# Altium project FMCOMMS3_compatible_board.PrjPcb
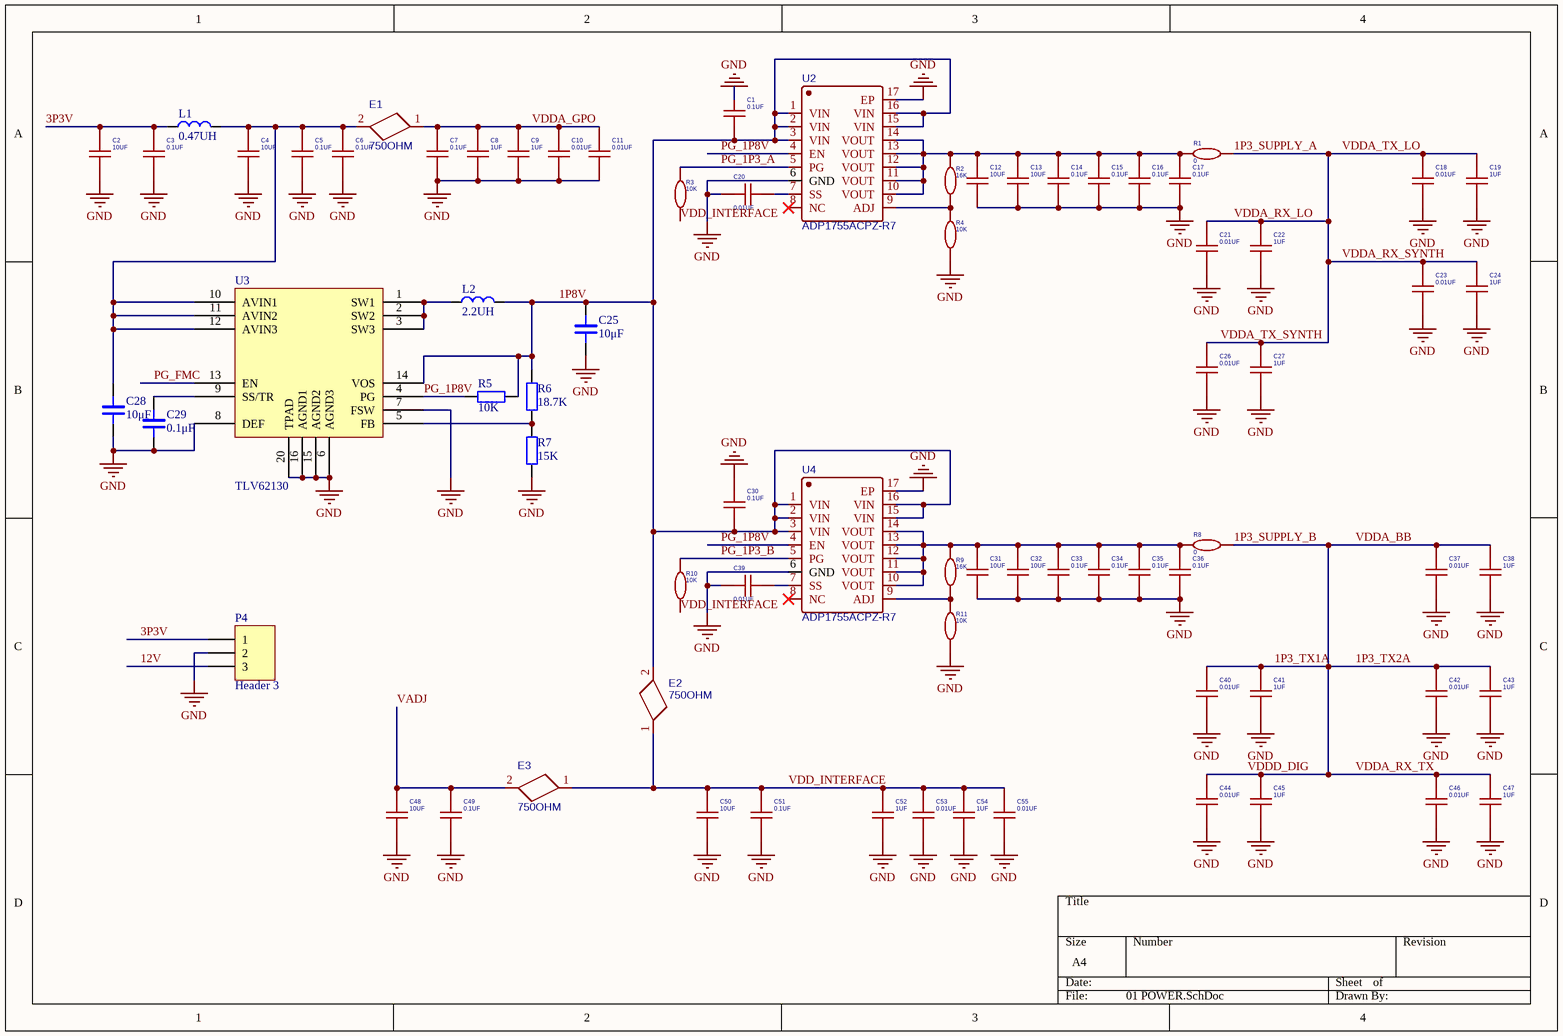
[diagram p0: 01 POWER.SchDoc]
3 sheets, 167 parts. Net scope: global (net labels, ports and power ports of the same name join across sheets).
Board file: FMCOMMS3.PcbDoc
Sheets:
  01 POWER.SchDoc
  02 LP_FMC.SchDoc
  03 AD9361_Digital.SchDoc

## Sheet 01 POWER.SchDoc
size A4

### Parts
C1  0.1UF  [C0402]
C2  10UF  [C0402]
C3  0.1UF  [C0402]
C4  10UF  [C0402]
C5  0.1UF  [C0402]
C6  0.1UF  [C0402]
C7  0.1UF  [C0402]
C8  1UF  [C0402]
C9  1UF  [C0402]
C10  0.01UF  [C0201]
C11  0.01UF  [C0201]
C12  10UF  [C0402]
C13  10UF  [C0402]
C14  0.1UF  [C0402]
C15  0.1UF  [C0402]
C16  0.1UF  [C0402]
C17  0.1UF  [C0402]
C18  0.01UF  [C0201]
C19  1UF  [C0402]
C20  0.01UF  [C0201]
C21  0.01UF  [C0201]
C22  1UF  [C0402]
C23  0.01UF  [C0201]
C24  1UF  [C0402]
C25  10μF  [C0402]
C26  0.01UF  [C0201]
C27  1UF  [C0402]
C28  10μF  [C0402]
C29  0.1μF  [C0402]
C30  0.1UF  [C0402]
C31  10UF  [C0402]
C32  10UF  [C0402]
C33  0.1UF  [C0402]
C34  0.1UF  [C0402]
C35  0.1UF  [C0402]
C36  0.1UF  [C0402]
C37  0.01UF  [C0402]
C38  1UF  [C0402]
C39  0.01UF  [C0402]
C40  0.01UF  [C0402]
C41  1UF  [C0402]
C42  0.01UF  [C0201]
C43  1UF  [C0402]
C44  0.01UF  [C0201]
C45  1UF  [C0402]
C46  0.01UF  [C0402]
C47  1UF  [C0402]
C48  10UF  [C0603]
C49  0.1UF  [C0402]
C50  10UF  [C0402]
C51  0.1UF  [C0201]
C52  1UF  [C0402]
C53  0.01UF  [C0201]
C54  1UF  [C0402]
C55  0.01UF  [C0201]
E1  750OHM  [L0402]
E2  750OHM  [L0402]
E3  750OHM  [L0402]
L1  0.47UH  [L1008]
L2  2.2UH  [L1008]
P4  Header 3  [CNBERG1X3H205LD36]
R1  0  [R1206]
R2  16K  [LC-0402_R]
R3  10K  [C0201]
R4  10K  [LC-0402_R]
R5  10K  [LC-0402_R]
R6  18.7K  [LC-0402_R]
R7  15K  [LC-0402_R]
R8  0  [R1206]
R9  16K  [LC-0402_R]
R10  10K  [LC-0402_R]
R11  10K  [LC-0402_R]
U2  ADP1755ACPZ-R7  [LFCSP-WQ-16_L4.0-W4.0-P0.65-EP2.3-BL-EP]
U3  TLV62130  [TLV62130RGT]
U4  ADP1755ACPZ-R7  [LFCSP-WQ-16_L4.0-W4.0-P0.65-EP2.3-BL-EP]

### Nets
GND: C1.1 C2.2 C3.2 C4.2 C5.2 C6.2 C7.2 C8.2 C9.2 C10.2 C11.2 C12.2 C13.2 C14.2 C15.2 C16.2 C17.2 C18.2 C19.2 C20.2 C21.2 C22.2 C23.2 C24.2 C25.1 C26.2 C27.2 C28.1 C29.1 C30.1 C31.2 C32.2 C33.2 C34.2 C35.2 C36.2 C37.2 C38.2 C39.2 C40.2 C41.2 C42.2 C43.2 C44.2 C45.2 C46.2 C47.2 C48.2 C49.2 C50.2 C51.2 C52.2 C53.2 C54.2 C55.2 P4.2 R4.1 R7.2 R11.1 U2.6(GND) U2.17(EP) U3.6(AGND3) U3.7(FSW) U3.8(DEF) U3.15(AGND2) U3.16(AGND1) U3.20(TPAD) U4.6(GND) U4.17(EP)
VDD_INTERFACE: C50.1 C51.1 C52.1 C53.1 C54.1 C55.1 E2.1 E3.1 R3.1 R10.1
1P3_SUPPLY_A: C18.1 C19.1 C21.1 C22.1 C23.1 C24.1 C26.1 C27.1 R1.2  [also labelled VDDA_RX_LO, VDDA_RX_SYNTH, VDDA_TX_LO, VDDA_TX_SYNTH]
1P3_SUPPLY_B: C37.1 C38.1 C40.1 C41.1 C42.1 C43.1 C44.1 C45.1 C46.1 C47.1 R8.2  [also labelled 1P3_TX1A, 1P3_TX2A, VDDA_BB, VDDA_RX_TX, VDDD_DIG]
1P8V: C1.2 C25.2 C30.2 E2.2 L2.2 R5.1 R6.1 U2.1(VIN) U2.2(VIN) U2.3(VIN) U2.15(VIN) U2.16(VIN) U3.14(VOS) U4.1(VIN) U4.2(VIN) U4.3(VIN) U4.15(VIN) U4.16(VIN)
3P3V: C2.1 C3.1 L1.1 P4.1
12V: P4.3
PG_1P3_A: R3.2 U2.5(PG)
PG_1P3_B: R10.2 U4.5(PG)
PG_1P8V: R5.2 U2.4(EN) U3.4(PG) U4.4(EN)
PG_FMC: U3.13(EN)
VADJ: C48.1 C49.1 E3.2
VDDA_GPO: C7.1 C8.1 C9.1 C10.1 C11.1 E1.1
NetC4_1: C4.1 C5.1 C6.1 C28.2 E1.2 L1.2 U3.10(AVIN1) U3.11(AVIN2) U3.12(AVIN3)
NetC12_1: C12.1 C13.1 C14.1 C15.1 C16.1 C17.1 R1.1 R2.2 U2.10(VOUT) U2.11(VOUT) U2.12(VOUT) U2.13(VOUT) U2.14(VOUT)
NetC20_1: C20.1 U2.7(SS)
NetC29_2: C29.2 U3.9(SS/TR)
NetC31_1: C31.1 C32.1 C33.1 C34.1 C35.1 C36.1 R8.1 R9.2 U4.10(VOUT) U4.11(VOUT) U4.12(VOUT) U4.13(VOUT) U4.14(VOUT)
NetC39_1: C39.1 U4.7(SS)
NetL2_1: L2.1 U3.1(SW1) U3.2(SW2) U3.3(SW3)
NetR2_1: R2.1 R4.2 U2.9(ADJ)
NetR6_2: R6.2 R7.1 U3.5(FB)
NetR9_1: R9.1 R11.2 U4.9(ADJ)

Not connected (* = marked no-connect by the designer): U2 8(NC)*; U4 8(NC)*

### Library data of the parts
C1 C3 C5-C7 C14-C17 C30 C33-C36 C49 C51 = 0.1UF: BOM_Manufacturer: WTC; BOM_Manufacturer Part: 0402B104K160; nameAlias: Capacitance; BOM_Supplier: LCSC; BOM_Supplier Part: C83056; spicePre: C; spiceSymbolName: 0402B104K160
C2 C4 C8-C13 C18 C19 C21-C24 C26 C27 C31 C32 C37 C38 C40-C48 C50 C52-C55 = 10UF: BOM_Manufacturer: WTC; BOM_Manufacturer Part: 0402B104K160; nameAlias: Capacitance; BOM_Supplier: LCSC; BOM_Supplier Part: C83056; spicePre: C; spiceSymbolName: 0402B104K160
C20 C39 = 0.01UF: BOM_Manufacturer: WTC; BOM_Manufacturer Part: 0402B104K160; nameAlias: Capacitance; BOM_Supplier: LCSC; BOM_Supplier Part: C83056; spicePre: C; spiceSymbolName: 0402B104K160
C25 C28 C29 = CAP_3: Capacitor
E1-E3 = 100OHM: BOM_Manufacturer: Murata; BOM_Manufacturer Part: BLM21PG221SN1x; Contributor: prophetC; BOM_Supplier: LCSC; spicePre: L; spiceSymbolName: 220ohm at 100MHz
L1 L2 = INDUCTANCE_1: Inductance
P4 = Header 3: Header, 3-Pin; LatestRevisionDate: 17-Jul-2002; LatestRevisionNote: Re-released for DXP Platform.; Publisher: Altium Limited
R1 R8 = 1: BOM_Manufacturer: YAGEO; BOM_Manufacturer Part: RC0402FR-0780R6L; nameAlias: Resistance (Ohms); Contributor: LCSC; BOM_Supplier: LCSC; BOM_Supplier Part: C185392; spicePre: R; spiceSymbolName: RC0402FR-0780R6L
R2-R4 R9-R11 = 10K: BOM_Manufacturer: YAGEO; BOM_Manufacturer Part: RC0402FR-0780R6L; nameAlias: Resistance (Ohms); Contributor: LCSC; BOM_Supplier: LCSC; BOM_Supplier Part: C185392; spicePre: R; spiceSymbolName: RC0402FR-0780R6L
R5-R7 = RES: Resistor
U2 U4 = ADP1755ACPZ-R7: BOM_Manufacturer: Analog Devices; Contributor: LCSC; BOM_Paste Type: expand; BOM_Supplier: LCSC; BOM_Supplier Part: C403695; BOM_Manufacturer Part: ADP1755ACPZ-R7; spicePre: U; spiceSymbolName: ADP1755ACPZ-R7

## Sheet 02 LP_FMC.SchDoc
size A4
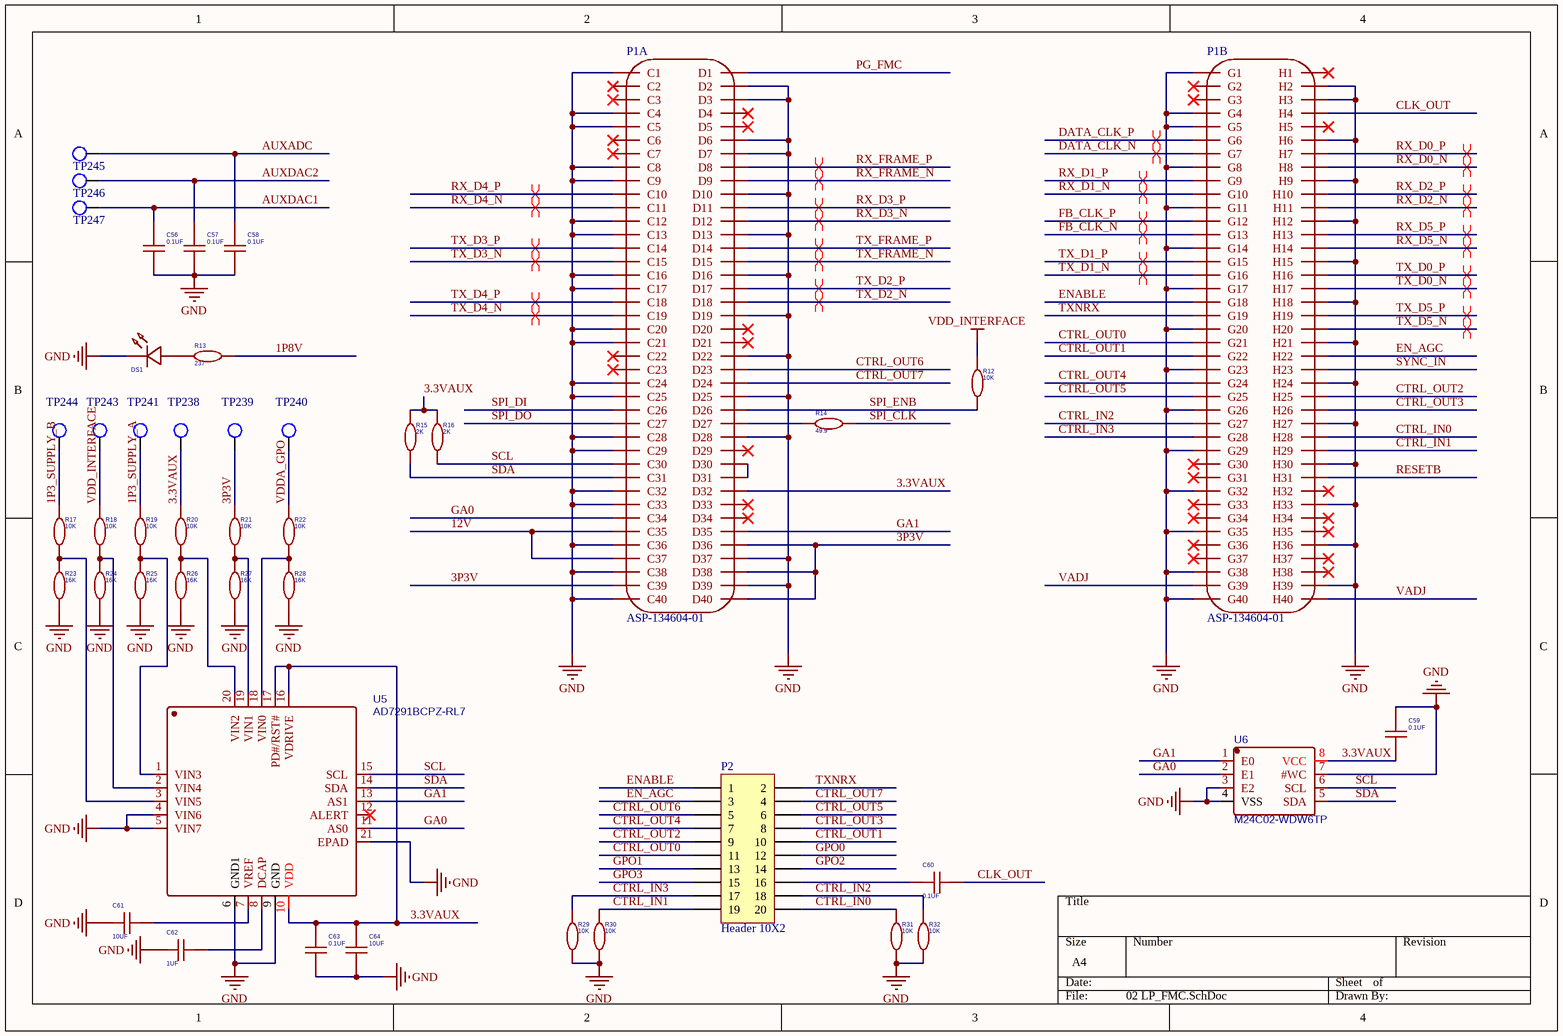
[diagram p1: 02 LP_FMC.SchDoc]

### Parts
C56  0.1UF  [C0201]
C57  0.1UF  [C0402]
C58  0.1UF  [C0201]
C59  0.1UF  [C0402]
C60  0.1UF  [C0402]
C61  10UF  [C0402]
C62  1UF  [C0402]
C63  0.1UF  [C0201]
C64  10UF  [C0402]
DS1  16-213SURC/S530-A3/TR8  [LED0805-RD]  (value not drawn)
P1  ASP-134604-01  [CNSAMTECASP-134604-01]  (parts A,B of 2)
P2  Header 10X2  [CNBERGF2X10H335LD32]
R12  10K  [C0201]
R13  237  [LC-0402_R]
R14  49.9  [C0201]
R15  2K  [C0201]
R16  2K  [C0201]
R17  10K  [C0201]
R18  10K  [C0201]
R19  10K  [C0201]
R20  10K  [C0201]
R21  10K  [C0201]
R22  10K  [C0201]
R23  16K  [C0201]
R24  16K  [C0201]
R25  16K  [C0201]
R26  16K  [C0201]
R27  16K  [C0201]
R28  16K  [C0201]
R29  10K  [C0201]
R30  10K  [C0201]
R31  10K  [C0201]
R32  10K  [C0201]
TP238  TEST POINT SURFACE  [TPC75D45]  (value not drawn)
TP239  TEST POINT SURFACE  [TPC75D45]  (value not drawn)
TP240  TEST POINT SURFACE  [TPC75D45]  (value not drawn)
TP241  TEST POINT SURFACE  [TPC75D45]  (value not drawn)
TP243  TEST POINT SURFACE  [TPC75D45]  (value not drawn)
TP244  TEST POINT SURFACE  [TPC75D45]  (value not drawn)
TP245  TEST POINT SURFACE  [TPC75D45]  (value not drawn)
TP246  TEST POINT SURFACE  [TPC75D45]  (value not drawn)
TP247  TEST POINT SURFACE  [TPC75D45]  (value not drawn)
U5  AD7291BCPZ-RL7  [LFCSP-20_L4.0-W4.0-P0.50-TL-EP2.7]
U6  M24C02-WDW6TP  [TSSOP8]

### Nets
GND: C56.2 C57.2 C58.2 C59.1 C61.1 C62.2 C63.2 C64.2 DS1.1(-) P1.C1 P1.C4 P1.C5 P1.C8 P1.C9 P1.C12 P1.C13 P1.C16 P1.C17 P1.C20 P1.C21 P1.C24 P1.C25 P1.C28 P1.C29 P1.C32 P1.C33 P1.C36 P1.C38 P1.C40 P1.D2 P1.D3 P1.D6 P1.D7 P1.D10 P1.D13 P1.D16 P1.D19 P1.D22 P1.D25 P1.D28 P1.D37 P1.D39 P1.G1 P1.G4 P1.G5 P1.G8 P1.G11 P1.G14 P1.G17 P1.G20 P1.G23 P1.G26 P1.G29 P1.G32 P1.G35 P1.G38 P1.G40 P1.H2 P1.H3 P1.H6 P1.H9 P1.H12 P1.H15 P1.H18 P1.H21 P1.H24 P1.H27 P1.H30 P1.H33 P1.H36 P1.H39 R23.2 R24.2 R25.2 R26.2 R27.2 R28.2 R29.1 R30.1 R31.1 R32.1 U5.4(VIN6) U5.5(VIN7) U5.6(GND1) U5.9(GND) U5.21(EPAD) U6.3(E2) U6.4(VSS) U6.7(#WC)
VDD_INTERFACE: R12.2 R18.1 TP243.1(TP)
1P3_SUPPLY_A: R19.1 TP241.1(TP)
1P3_SUPPLY_B: R17.1 TP244.1(TP)
1P8V: R13.2
3.3VAUX: C59.2 C63.1 C64.1 P1.D32 R15.2 R16.2 R20.1 TP238.1(TP) U5.10(VDD) U5.16(VDRIVE) U5.17(PD#/RST#) U6.8(VCC)
3P3V: P1.C39 P1.D36 P1.D38 P1.D40 R21.1 TP239.1(TP)
12V: P1.C35 P1.C37
AUXADC: C58.1 TP245.1(TP)
AUXDAC1: C56.1 TP247.1(TP)
AUXDAC2: C57.1 TP246.1(TP)
CLK_OUT: C60.2 P1.H4
CTRL_IN0: P1.H28 P2.20 R31.2
CTRL_IN1: P1.H29 P2.19 R30.2
CTRL_IN2: P1.G27 P2.18 R32.2
CTRL_IN3: P1.G28 P2.17 R29.2
CTRL_OUT0: P1.G21 P2.11
CTRL_OUT1: P1.G22 P2.10
CTRL_OUT2: P1.H25 P2.9
CTRL_OUT3: P1.H26 P2.8
CTRL_OUT4: P1.G24 P2.7
CTRL_OUT5: P1.G25 P2.6
CTRL_OUT6: P1.D23 P2.5
CTRL_OUT7: P1.D24 P2.4
DATA_CLK_N: P1.G7
DATA_CLK_P: P1.G6
EN_AGC: P1.H22 P2.3
ENABLE: P1.G18 P2.1
FB_CLK_N: P1.G13
FB_CLK_P: P1.G12
GA0: P1.C34 U5.11(AS0) U6.2(E1)
GA1: P1.D35 U5.13(AS1) U6.1(E0)
GPO0: P2.12
GPO1: P2.13
GPO2: P2.14
GPO3: P2.15
PG_FMC: P1.D1
RESETB: P1.H31
RX_D0_N: P1.H8
RX_D0_P: P1.H7
RX_D1_N: P1.G10
RX_D1_P: P1.G9
RX_D2_N: P1.H11
RX_D2_P: P1.H10
RX_D3_N: P1.D12
RX_D3_P: P1.D11
RX_D4_N: P1.C11
RX_D4_P: P1.C10
RX_D5_N: P1.H14
RX_D5_P: P1.H13
RX_FRAME_N: P1.D9
RX_FRAME_P: P1.D8
SCL: P1.C30 R16.1 U5.15(SCL) U6.6(SCL)
SDA: P1.C31 R15.1 U5.14(SDA) U6.5(SDA)
SPI_CLK: R14.2
SPI_DI: P1.C26
SPI_DO: P1.C27
SPI_ENB: P1.D26 R12.1
SYNC_IN: P1.H23
TX_D0_N: P1.H17
TX_D0_P: P1.H16
TX_D1_N: P1.G16
TX_D1_P: P1.G15
TX_D2_N: P1.D18
TX_D2_P: P1.D17
TX_D3_N: P1.C15
TX_D3_P: P1.C14
TX_D4_N: P1.C19
TX_D4_P: P1.C18
TX_D5_N: P1.H20
TX_D5_P: P1.H19
TX_FRAME_N: P1.D15
TX_FRAME_P: P1.D14
TXNRX: P1.G19 P2.2
VADJ: P1.G39 P1.H40
VDDA_GPO: R22.1 TP240.1(TP)
NetC60_1: C60.1 P2.16
NetC61_2: C61.2 U5.7(VREF)
NetC62_1: C62.1 U5.8(DCAP)
NetDS1_2: DS1.2(+) R13.1
NetP1_D27: P1.D27 R14.1
NetP1_D30: P1.D30 P1.D31
NetR17_2: R17.2 R23.1 U5.3(VIN5)
NetR18_2: R18.2 R24.1 U5.2(VIN4)
NetR19_2: R19.2 R25.1 U5.1(VIN3)
NetR20_2: R20.2 R26.1 U5.20(VIN2)
NetR21_2: R21.2 R27.1 U5.19(VIN1)
NetR22_2: R22.2 R28.1 U5.18(VIN0)

Not connected (* = marked no-connect by the designer): P1 C2* C3* C6* C7* C22* C23* D4* D5* D20* D21* D29* D33* D34* G2* G3* G30* G31* G33* G34* G36* G37* H1* H5* H32* H34* H35* H37* H38*; U5 12(ALERT)*

### Layout directives
differential pair: DATA_CLK_N, DATA_CLK_P, FB_CLK_N, FB_CLK_P, RX_D0_N, RX_D0_P, RX_D1_N, RX_D1_P, RX_D2_N, RX_D2_P, RX_D3_N, RX_D3_P, RX_D4_N, RX_D4_P, RX_D5_N, RX_D5_P, RX_FRAME_N, RX_FRAME_P, TX_D0_N, TX_D0_P, TX_D1_N, TX_D1_P, TX_D2_N, TX_D2_P, TX_D3_N, TX_D3_P, TX_D4_N, TX_D4_P, TX_D5_N, TX_D5_P, TX_FRAME_N, TX_FRAME_P

### Library data of the parts
C56-C60 C62 C63 = 0.1UF: as C1 on sheet 01 POWER; BOM_Supplier: LCSC; BOM_Supplier Part: C83056; spicePre: C; spiceSymbolName: 0402B104K160
C61 C64 = 10UF: as C2 on sheet 01 POWER; BOM_Supplier: LCSC; BOM_Supplier Part: C83056; spicePre: C; spiceSymbolName: 0402B104K160
DS1 = 16-213SURC/S530-A3/TR8: BOM_Manufacturer: Everlight Elec; Contributor: LCSC; BOM_Supplier: LCSC; BOM_Supplier Part: C605452; BOM_Manufacturer Part: 16-213SURC/S530-A3/TR8; spicePre: L; spiceSymbolName: 16-213SURC/S530-A3/TR8
P2 = Header 10X2: Header, 10-Pin, Dual row; LatestRevisionDate: 17-Jul-2002; LatestRevisionNote: Re-released for DXP Platform.; Publisher: Altium Limited
R12 R17-R32 = 10K: as R2 on sheet 01 POWER; BOM_Supplier: LCSC; BOM_Supplier Part: C185392; spicePre: R; spiceSymbolName: RC0402FR-0780R6L
R13 = 10R: BOM_Manufacturer: YAGEO; BOM_Manufacturer Part: RC0402FR-0780R6L; nameAlias: Resistance (Ohms); Contributor: LCSC; BOM_Supplier: LCSC; BOM_Supplier Part: C185392; spicePre: R; spiceSymbolName: RC0402FR-0780R6L
R14 = 39: BOM_Manufacturer: YAGEO; BOM_Manufacturer Part: RC0402FR-0780R6L; nameAlias: Resistance (Ohms); Contributor: LCSC; BOM_Supplier: LCSC; BOM_Supplier Part: C185392; spicePre: R; spiceSymbolName: RC0402FR-0780R6L
R15 R16 = 1K: BOM_Manufacturer: YAGEO; BOM_Manufacturer Part: RC0402FR-0780R6L; nameAlias: Resistance (Ohms); Contributor: LCSC; BOM_Supplier: LCSC; BOM_Supplier Part: C185392; spicePre: R; spiceSymbolName: RC0402FR-0780R6L
TP238-TP241 TP243-TP247 = TEST POINT SURFACE_1
U5 = AD7291BCPZ-RL7: BOM_Manufacturer: Analog Devices; Contributor: LCSC; BOM_Paste Type: expand; BOM_Supplier: LCSC; BOM_Supplier Part: C207434; BOM_Manufacturer Part: AD7291BCPZ-RL7; spicePre: U; spiceSymbolName: AD7291BCPZ-RL7
U6 = M24C02-WDW6TP: BOM_Manufacturer: STMicroelectronics; Contributor: LCSC; BOM_Paste Type: expand; BOM_Supplier: LCSC; BOM_Supplier Part: C283436; BOM_Manufacturer Part: M24C02-WDW6TP; spicePre: U; spiceSymbolName: M24C02-WDW6TP

## Sheet 03 AD9361_Digital.SchDoc
size A3
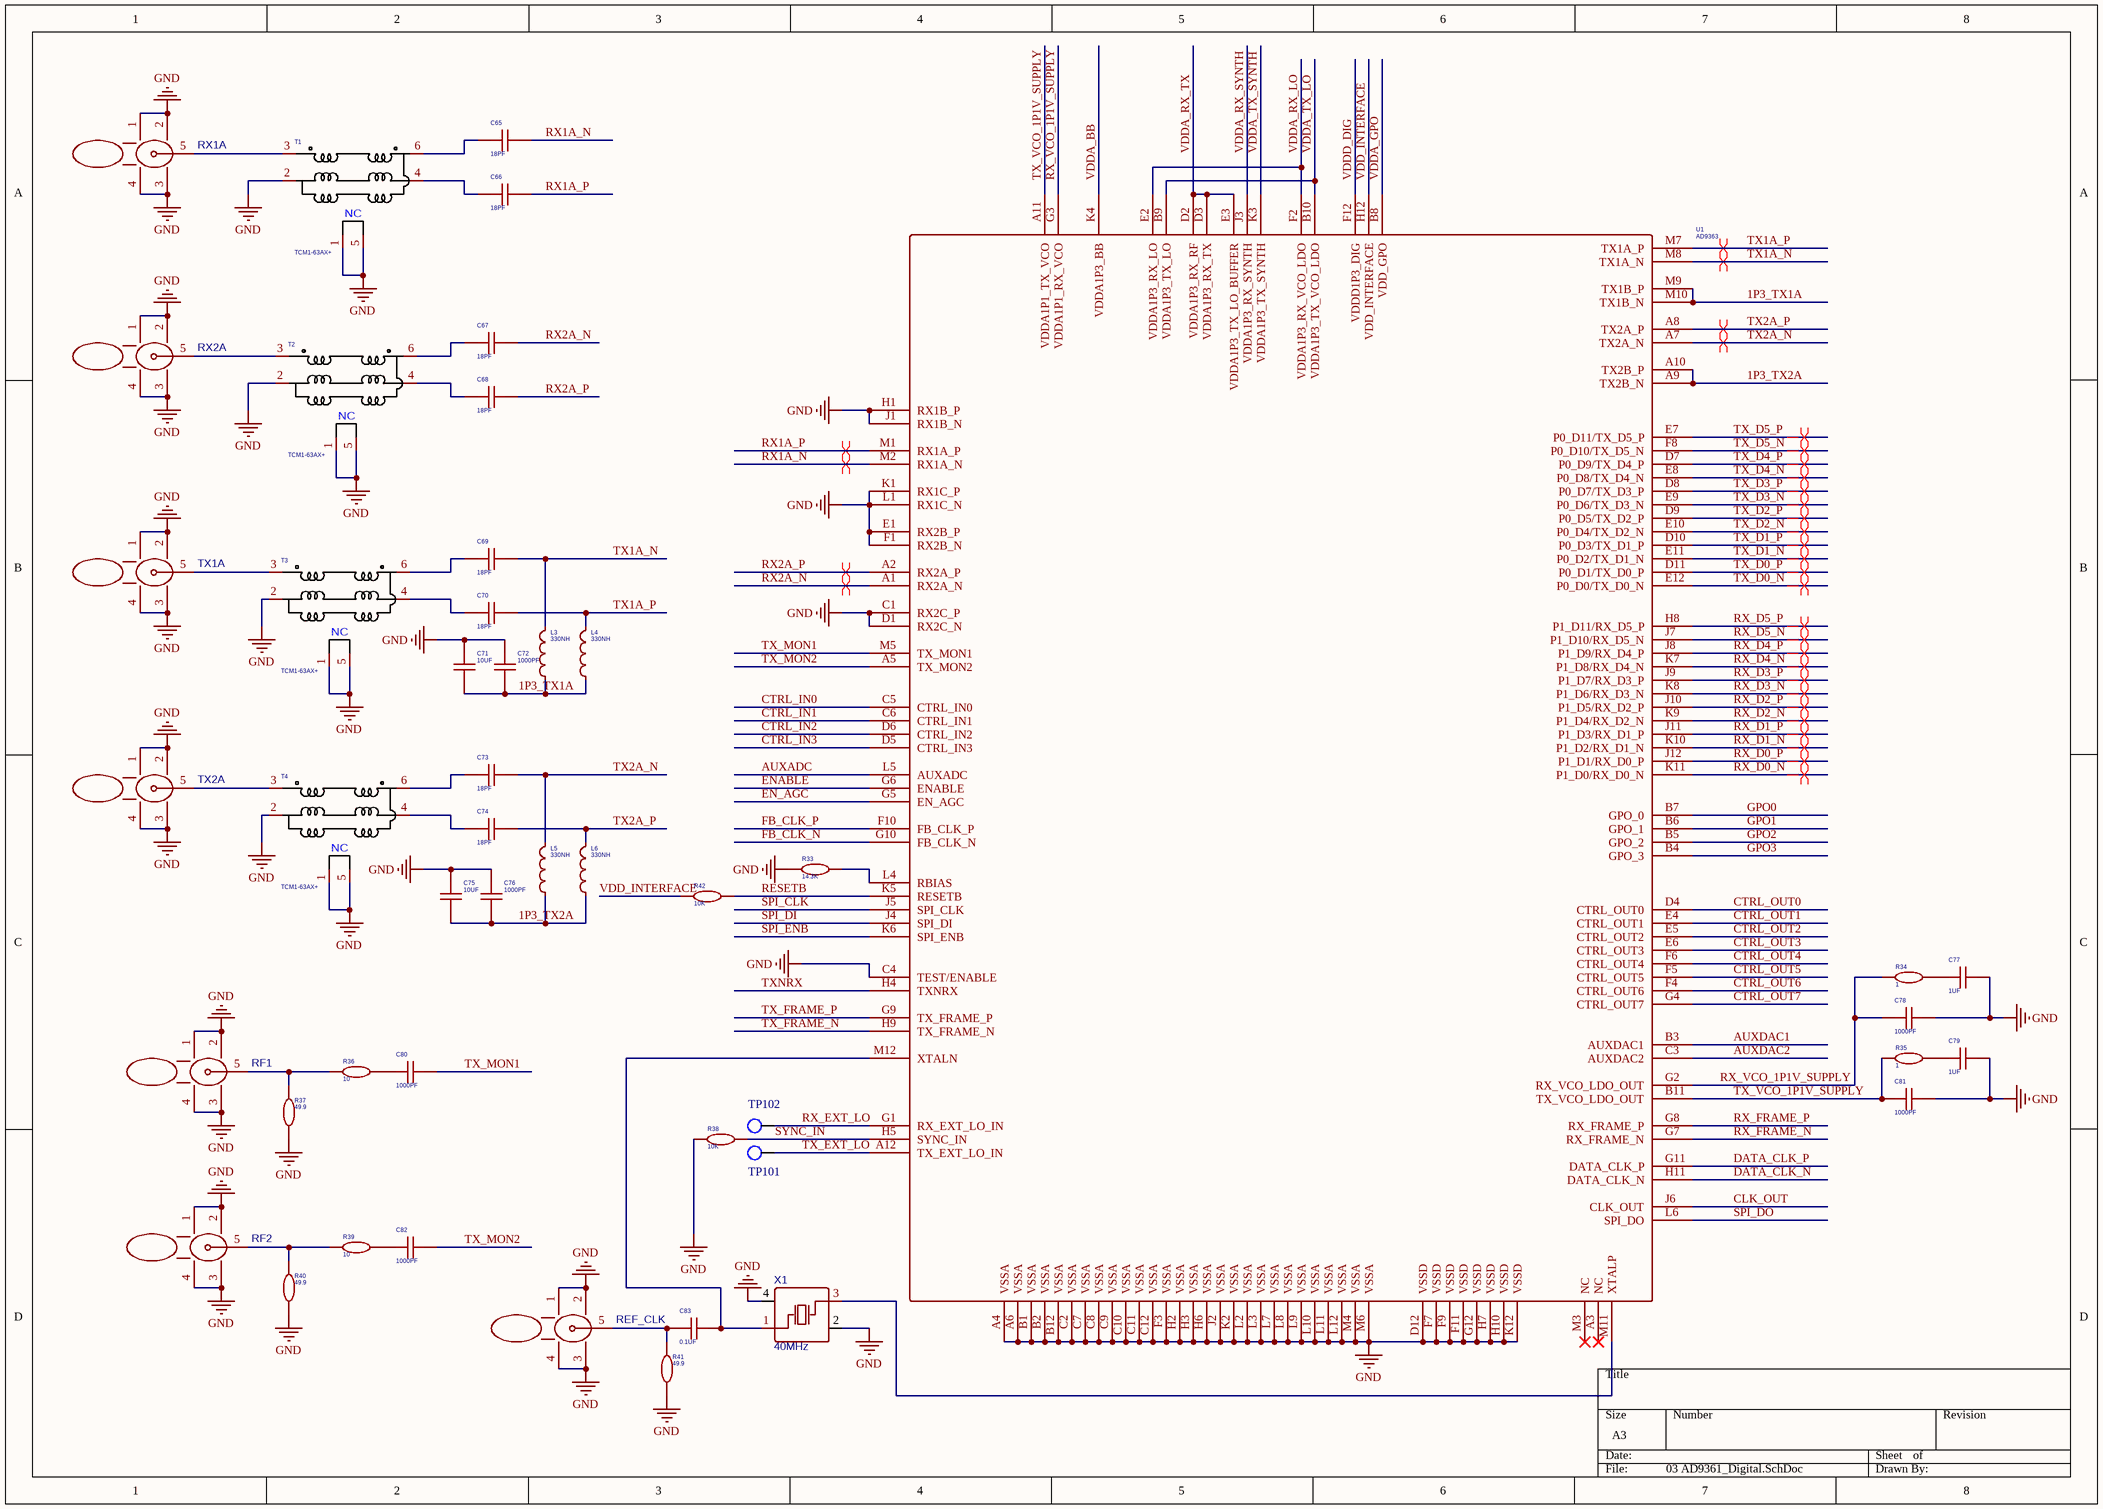
[diagram p2: 03 AD9361_Digital.SchDoc]

### Parts
C65  18PF  [C0201]
C66  18PF  [C0201]
C67  18PF  [C0201]
C68  18PF  [C0201]
C69  18PF  [C0201]
C70  18PF  [C0201]
C71  10UF  [C0402]
C72  1000PF  [C0201]
C73  18PF  [C0201]
C74  18PF  [C0201]
C75  10UF  [C0603]
C76  1000PF  [C0402]
C77  1UF  [C0402]
C78  1000PF  [C0201]
C79  1UF  [C0402]
C80  1000PF  [C0201]
C81  1000PF  [C0201]
C82  1000PF  [C0201]
C83  0.1UF  [C0402]
L3  330NH  [L0805-F]
L4  330NH  [L0805-F]
L5  330NH  [L0805-F]
L6  330NH  [L0805-F]
R33  14.3K  [C0201]
R34  1  [C0201]
R35  1  [C0201]
R36  10  [C0201]
R37  49.9  [LC-0402_R]
R38  10K  [C0201]
R39  10  [C0201]
R40  49.9  [C0201]
R41  49.9  [LC-0402_R]
R42  10K  [R0201]
REF_CLK  DOSIN-806-0010  [CNJOHNSON142-0701-201]  (value not drawn)
RF1  DOSIN-806-0010  [CNSMARAL687W375H171]  (value not drawn)
RF2  DOSIN-806-0010  [CNSMARAL687W375H171]  (value not drawn)
RX1A  DOSIN-806-0010  [CNSMARAL687W375H171]  (value not drawn)
RX2A  DOSIN-806-0010  [CNSMARAL687W375H171]  (value not drawn)
T1  TCM1-63AX+  [TSML150W160H160]
T2  TCM1-63AX+  [TSML150W160H160]
T3  TCM1-63AX+  [TSML150W160H160]
T4  TCM1-63AX+  [TSML150W160H160]
TP101  TEST POINT SURFACE  [TPC75D45]  (value not drawn)
TP102  TEST POINT SURFACE  [TPC75D45]  (value not drawn)
TX1A  DOSIN-806-0010  [CNSMARAL687W375H171]  (value not drawn)
TX2A  DOSIN-806-0010  [CNSMARAL687W375H171]  (value not drawn)
U1  AD9363  [AD936X]
X1  40MHz  [XTALNX3225]

### Nets
GND: C71.1 C72.1 C75.1 C76.1 C77.1 C78.2 C79.1 C81.2 R33.1 R37.1 R38.1 R40.1 R41.1 REF_CLK.1 REF_CLK.2 REF_CLK.3 REF_CLK.4 RF1.1 RF1.2 RF1.3 RF1.4 RF2.1 RF2.2 RF2.3 RF2.4 RX1A.1 RX1A.2 RX1A.3 RX1A.4 RX2A.1 RX2A.2 RX2A.3 RX2A.4 T1.1(NC) T1.2 T1.5(NC) T2.1(NC) T2.2 T2.5(NC) T3.1(NC) T3.2 T3.5(NC) T4.1(NC) T4.2 T4.5(NC) TX1A.1 TX1A.2 TX1A.3 TX1A.4 TX2A.1 TX2A.2 TX2A.3 TX2A.4 U1.A4(VSSA) U1.A6(VSSA) U1.B1(VSSA) U1.B2(VSSA) U1.B12(VSSA) U1.C1(RX2C_P) U1.C2(VSSA) U1.C4(TEST/ENABLE) U1.C7(VSSA) U1.C8(VSSA) U1.C9(VSSA) U1.C10(VSSA) U1.C11(VSSA) U1.C12(VSSA) U1.D1(RX2C_N) U1.D12(VSSD) U1.E1(RX2B_P) U1.F1(RX2B_N) U1.F3(VSSA) U1.F7(VSSD) U1.F9(VSSD) U1.F11(VSSD) U1.G12(VSSD) U1.H1(RX1B_P) U1.H2(VSSA) U1.H3(VSSA) U1.H6(VSSA) U1.H7(VSSD) U1.H10(VSSD) U1.J1(RX1B_N) U1.J2(VSSA) U1.K1(RX1C_P) U1.K2(VSSA) U1.K12(VSSD) U1.L1(RX1C_N) U1.L2(VSSA) U1.L3(VSSA) U1.L7(VSSA) U1.L8(VSSA) U1.L9(VSSA) U1.L10(VSSA) U1.L11(VSSA) U1.L12(VSSA) U1.M4(VSSA) U1.M6(VSSA) X1.2(GND) X1.4(GND)
VDD_INTERFACE: R42.1 U1.H12(VDD_INTERFACE)
1P3_TX1A: C71.2 C72.2 C75.2 C76.2 L3.1 L4.1 L5.1 L6.1 U1.A9(TX2B_N) U1.A10(TX2B_P) U1.D2(VDDA1P3_RX_RF) U1.D3(VDDA1P3_RX_TX) U1.E3(VDDA1P3_TX_LO_BUFFER) U1.F12(VDDD1P3_DIG) U1.K4(VDDA1P3_BB) U1.M9(TX1B_P) U1.M10(TX1B_N)  [also labelled 1P3_TX2A, VDDA_BB, VDDA_RX_TX, VDDD_DIG]  [project net 1P3_SUPPLY_B]
AUXADC: U1.L5(AUXADC)
AUXDAC1: U1.B3(AUXDAC1)
AUXDAC2: U1.C3(AUXDAC2)
CLK_OUT: U1.J6(CLK_OUT)
CTRL_IN0: U1.C5(CTRL_IN0)
CTRL_IN1: U1.C6(CTRL_IN1)
CTRL_IN2: U1.D6(CTRL_IN2)
CTRL_IN3: U1.D5(CTRL_IN3)
CTRL_OUT0: U1.D4(CTRL_OUT0)
CTRL_OUT1: U1.E4(CTRL_OUT1)
CTRL_OUT2: U1.E5(CTRL_OUT2)
CTRL_OUT3: U1.E6(CTRL_OUT3)
CTRL_OUT4: U1.F6(CTRL_OUT4)
CTRL_OUT5: U1.F5(CTRL_OUT5)
CTRL_OUT6: U1.F4(CTRL_OUT6)
CTRL_OUT7: U1.G4(CTRL_OUT7)
DATA_CLK_N: U1.H11(DATA_CLK_N)
DATA_CLK_P: U1.G11(DATA_CLK_P)
EN_AGC: U1.G5(EN_AGC)
ENABLE: U1.G6(ENABLE)
FB_CLK_N: U1.G10(FB_CLK_N)
FB_CLK_P: U1.F10(FB_CLK_P)
GPO0: U1.B7(GPO_0)
GPO1: U1.B6(GPO_1)
GPO2: U1.B5(GPO_2)
GPO3: U1.B4(GPO_3)
RESETB: R42.2 U1.K5(RESETB)
RX1A_N: C65.1 U1.M2(RX1A_N)
RX1A_P: C66.1 U1.M1(RX1A_P)
RX2A_N: C67.1 U1.A1(RX2A_N)
RX2A_P: C68.1 U1.A2(RX2A_P)
RX_D0_N: U1.K11(P1_D0/RX_D0_N)
RX_D0_P: U1.J12(P1_D1/RX_D0_P)
RX_D1_N: U1.K10(P1_D2/RX_D1_N)
RX_D1_P: U1.J11(P1_D3/RX_D1_P)
RX_D2_N: U1.K9(P1_D4/RX_D2_N)
RX_D2_P: U1.J10(P1_D5/RX_D2_P)
RX_D3_N: U1.K8(P1_D6/RX_D3_N)
RX_D3_P: U1.J9(P1_D7/RX_D3_P)
RX_D4_N: U1.K7(P1_D8/RX_D4_N)
RX_D4_P: U1.J8(P1_D9/RX_D4_P)
RX_D5_N: U1.J7(P1_D10/RX_D5_N)
RX_D5_P: U1.H8(P1_D11/RX_D5_P)
RX_EXT_LO: TP102.1(TP) U1.G1(RX_EXT_LO_IN)
RX_FRAME_N: U1.G7(RX_FRAME_N)
RX_FRAME_P: U1.G8(RX_FRAME_P)
RX_VCO_1P1V_SUPPLY: C78.1 R34.1 U1.G2(RX_VCO_LDO_OUT) U1.G3(VDDA1P1_RX_VCO)
SPI_CLK: U1.J5(SPI_CLK)
SPI_DI: U1.J4(SPI_DI)
SPI_DO: U1.L6(SPI_DO)
SPI_ENB: U1.K6(SPI_ENB)
SYNC_IN: R38.2 U1.H5(SYNC_IN)
TX1A_N: C69.1 L3.2 U1.M8(TX1A_N)
TX1A_P: C70.1 L4.2 U1.M7(TX1A_P)
TX2A_N: C73.1 L5.2 U1.A7(TX2A_N)
TX2A_P: C74.1 L6.2 U1.A8(TX2A_P)
TX_D0_N: U1.E12(P0_D0/TX_D0_N)
TX_D0_P: U1.D11(P0_D1/TX_D0_P)
TX_D1_N: U1.E11(P0_D2/TX_D1_N)
TX_D1_P: U1.D10(P0_D3/TX_D1_P)
TX_D2_N: U1.E10(P0_D4/TX_D2_N)
TX_D2_P: U1.D9(P0_D5/TX_D2_P)
TX_D3_N: U1.E9(P0_D6/TX_D3_N)
TX_D3_P: U1.D8(P0_D7/TX_D3_P)
TX_D4_N: U1.E8(P0_D8/TX_D4_N)
TX_D4_P: U1.D7(P0_D9/TX_D4_P)
TX_D5_N: U1.F8(P0_D10/TX_D5_N)
TX_D5_P: U1.E7(P0_D11/TX_D5_P)
TX_EXT_LO: TP101.1(TP) U1.A12(TX_EXT_LO_IN)
TX_FRAME_N: U1.H9(TX_FRAME_N)
TX_FRAME_P: U1.G9(TX_FRAME_P)
TX_MON1: C80.2 U1.M5(TX_MON1)
TX_MON2: C82.2 U1.A5(TX_MON2)
TX_VCO_1P1V_SUPPLY: C81.1 R35.1 U1.A11(VDDA1P1_TX_VCO) U1.B11(TX_VCO_LDO_OUT)
TXNRX: U1.H4(TXNRX)
VDDA_GPO: U1.B8(VDD_GPO)
VDDA_RX_LO: U1.B9(VDDA1P3_TX_LO) U1.B10(VDDA1P3_TX_VCO_LDO) U1.E2(VDDA1P3_RX_LO) U1.F2(VDDA1P3_RX_VCO_LDO) U1.J3(VDDA1P3_RX_SYNTH) U1.K3(VDDA1P3_TX_SYNTH)  [also labelled VDDA_RX_SYNTH, VDDA_TX_LO, VDDA_TX_SYNTH]  [project net 1P3_SUPPLY_A]
NetC65_2: C65.2 T1.6
NetC66_2: C66.2 T1.4
NetC67_2: C67.2 T2.6
NetC68_2: C68.2 T2.4
NetC69_2: C69.2 T3.6
NetC70_2: C70.2 T3.4
NetC73_2: C73.2 T4.6
NetC74_2: C74.2 T4.4
NetC77_2: C77.2 R34.2
NetC79_2: C79.2 R35.2
NetC80_1: C80.1 R36.2
NetC82_1: C82.1 R39.2
NetC83_1: C83.1 U1.M12(XTALN) X1.1(OSC1)
NetC83_2: C83.2 R41.2 REF_CLK.5
NetR33_2: R33.2 U1.L4(RBIAS)
NetR36_1: R36.1 R37.2 RF1.5
NetR39_1: R39.1 R40.2 RF2.5
NetRX1A_5: RX1A.5 T1.3
NetRX2A_5: RX2A.5 T2.3
NetT3_3: T3.3 TX1A.5
NetT4_3: T4.3 TX2A.5
NetU1_M11: U1.M11(XTALP) X1.3(OSC2)

Not connected (* = marked no-connect by the designer): U1 A3(NC)* M3(NC)*

### Layout directives
differential pair: RX1A_N, RX1A_P, RX2A_N, RX2A_P, RX_D0_N, RX_D0_P, RX_D1_N, RX_D1_P, RX_D2_N, RX_D2_P, RX_D3_N, RX_D3_P, RX_D4_N, RX_D4_P, RX_D5_N, RX_D5_P, TX1A_N, TX1A_P, TX2A_N, TX2A_P, TX_D0_N, TX_D0_P, TX_D1_N, TX_D1_P, TX_D2_N, TX_D2_P, TX_D3_N, TX_D3_P, TX_D4_N, TX_D4_P, TX_D5_N, TX_D5_P

### Library data of the parts
C65-C70 C72-C74 C76 C80 C82 = 18PF: BOM_Manufacturer: WTC; BOM_Manufacturer Part: 0402B104K160; nameAlias: Capacitance; BOM_Supplier: LCSC; BOM_Supplier Part: C83056; spicePre: C; spiceSymbolName: 0402B104K160
C71 C75 = 10UF: as C2 on sheet 01 POWER; BOM_Supplier: LCSC; BOM_Supplier Part: C83056; spicePre: C; spiceSymbolName: 0402B104K160
C77 C79 C83 = 0.1UF: as C1 on sheet 01 POWER; BOM_Supplier: LCSC; BOM_Supplier Part: C83056; spicePre: C; spiceSymbolName: 0402B104K160
C78 C81 = 100PF: BOM_Manufacturer: WTC; BOM_Manufacturer Part: 0402B104K160; nameAlias: Capacitance; BOM_Supplier: LCSC; BOM_Supplier Part: C83056; spicePre: C; spiceSymbolName: 0402B104K160
L3-L6 = 330NH: BOM_Manufacturer: Sunlord; BOM_Manufacturer Part: GZ1608D121TF; nameAlias: Value; SMT Type: Extend; BOM_Supplier: LCSC; BOM_Supplier Part: C12391; BOM_JLCPCB SMD: Yes; spicePre: L; spiceSymbolName: GZ1608D121TF-C12391
R33 R38 R42 = 10K: as R2 on sheet 01 POWER; BOM_Supplier: LCSC; BOM_Supplier Part: C185392; spicePre: R; spiceSymbolName: RC0402FR-0780R6L
R34-R37 R39-R41 = 1: as R1 on sheet 01 POWER; BOM_Supplier: LCSC; BOM_Supplier Part: C185392; spicePre: R; spiceSymbolName: RC0402FR-0780R6L
REF_CLK RF1 RF2 RX1A RX2A TX1A TX2A = DOSIN-806-0010: BOM_Manufacturer: dosinconn; Contributor: LCSC; BOM_Supplier: LCSC; BOM_Supplier Part: C521221; BOM_Manufacturer Part: DOSIN-806-0010; spicePre: R; spiceSymbolName: DOSIN-806-0010
T1-T4 = TCM1-63AX+: Contributor: GaAs; spicePre: T; spiceSymbolName: TCM1-63AX+
TP101 TP102 = TEST POINT SURFACE_1
U1 = AD9363: Contributor: fumanduo; spicePre: U; spiceSymbolName: AD9363_PLUTO
X1 = 30MHz: BOM_Manufacturer: NDK; BOM_Manufacturer Part: NX3225SA-30M; nameAlias: Frequency; Contributor: LCSC; BOM_Supplier: LCSC; BOM_Supplier Part: C139739; spicePre: X; spiceSymbolName: NX3225SA-30M

## Nets that join several sheets
GND: 01 POWER (69 pins), 02 LP_FMC (89 pins), 03 AD9361_Digital (100 pins)
VDD_INTERFACE: 01 POWER (10 pins), 02 LP_FMC (R12.2 R18.1 TP243.1), 03 AD9361_Digital (R42.1 U1.H12)
1P3_SUPPLY_A: 01 POWER (9 pins), 02 LP_FMC (R19.1 TP241.1), 03 AD9361_Digital (6 pins)
1P3_SUPPLY_B: 01 POWER (11 pins), 02 LP_FMC (R17.1 TP244.1), 03 AD9361_Digital (17 pins)
1P8V: 01 POWER (18 pins), 02 LP_FMC (R13.2)
3P3V: 01 POWER (C2.1 C3.1 L1.1 P4.1), 02 LP_FMC (6 pins)
12V: 01 POWER (P4.3), 02 LP_FMC (P1.C35 P1.C37)
AUXADC: 02 LP_FMC (C58.1 TP245.1), 03 AD9361_Digital (U1.L5)
AUXDAC1: 02 LP_FMC (C56.1 TP247.1), 03 AD9361_Digital (U1.B3)
AUXDAC2: 02 LP_FMC (C57.1 TP246.1), 03 AD9361_Digital (U1.C3)
CLK_OUT: 02 LP_FMC (C60.2 P1.H4), 03 AD9361_Digital (U1.J6)
CTRL_IN0: 02 LP_FMC (P1.H28 P2.20 R31.2), 03 AD9361_Digital (U1.C5)
CTRL_IN1: 02 LP_FMC (P1.H29 P2.19 R30.2), 03 AD9361_Digital (U1.C6)
CTRL_IN2: 02 LP_FMC (P1.G27 P2.18 R32.2), 03 AD9361_Digital (U1.D6)
CTRL_IN3: 02 LP_FMC (P1.G28 P2.17 R29.2), 03 AD9361_Digital (U1.D5)
CTRL_OUT0: 02 LP_FMC (P1.G21 P2.11), 03 AD9361_Digital (U1.D4)
CTRL_OUT1: 02 LP_FMC (P1.G22 P2.10), 03 AD9361_Digital (U1.E4)
CTRL_OUT2: 02 LP_FMC (P1.H25 P2.9), 03 AD9361_Digital (U1.E5)
CTRL_OUT3: 02 LP_FMC (P1.H26 P2.8), 03 AD9361_Digital (U1.E6)
CTRL_OUT4: 02 LP_FMC (P1.G24 P2.7), 03 AD9361_Digital (U1.F6)
CTRL_OUT5: 02 LP_FMC (P1.G25 P2.6), 03 AD9361_Digital (U1.F5)
CTRL_OUT6: 02 LP_FMC (P1.D23 P2.5), 03 AD9361_Digital (U1.F4)
CTRL_OUT7: 02 LP_FMC (P1.D24 P2.4), 03 AD9361_Digital (U1.G4)
DATA_CLK_N: 02 LP_FMC (P1.G7), 03 AD9361_Digital (U1.H11)
DATA_CLK_P: 02 LP_FMC (P1.G6), 03 AD9361_Digital (U1.G11)
EN_AGC: 02 LP_FMC (P1.H22 P2.3), 03 AD9361_Digital (U1.G5)
ENABLE: 02 LP_FMC (P1.G18 P2.1), 03 AD9361_Digital (U1.G6)
FB_CLK_N: 02 LP_FMC (P1.G13), 03 AD9361_Digital (U1.G10)
FB_CLK_P: 02 LP_FMC (P1.G12), 03 AD9361_Digital (U1.F10)
GPO0: 02 LP_FMC (P2.12), 03 AD9361_Digital (U1.B7)
GPO1: 02 LP_FMC (P2.13), 03 AD9361_Digital (U1.B6)
GPO2: 02 LP_FMC (P2.14), 03 AD9361_Digital (U1.B5)
GPO3: 02 LP_FMC (P2.15), 03 AD9361_Digital (U1.B4)
PG_FMC: 01 POWER (U3.13), 02 LP_FMC (P1.D1)
RESETB: 02 LP_FMC (P1.H31), 03 AD9361_Digital (R42.2 U1.K5)
RX_D0_N: 02 LP_FMC (P1.H8), 03 AD9361_Digital (U1.K11)
RX_D0_P: 02 LP_FMC (P1.H7), 03 AD9361_Digital (U1.J12)
RX_D1_N: 02 LP_FMC (P1.G10), 03 AD9361_Digital (U1.K10)
RX_D1_P: 02 LP_FMC (P1.G9), 03 AD9361_Digital (U1.J11)
RX_D2_N: 02 LP_FMC (P1.H11), 03 AD9361_Digital (U1.K9)
RX_D2_P: 02 LP_FMC (P1.H10), 03 AD9361_Digital (U1.J10)
RX_D3_N: 02 LP_FMC (P1.D12), 03 AD9361_Digital (U1.K8)
RX_D3_P: 02 LP_FMC (P1.D11), 03 AD9361_Digital (U1.J9)
RX_D4_N: 02 LP_FMC (P1.C11), 03 AD9361_Digital (U1.K7)
RX_D4_P: 02 LP_FMC (P1.C10), 03 AD9361_Digital (U1.J8)
RX_D5_N: 02 LP_FMC (P1.H14), 03 AD9361_Digital (U1.J7)
RX_D5_P: 02 LP_FMC (P1.H13), 03 AD9361_Digital (U1.H8)
RX_FRAME_N: 02 LP_FMC (P1.D9), 03 AD9361_Digital (U1.G7)
RX_FRAME_P: 02 LP_FMC (P1.D8), 03 AD9361_Digital (U1.G8)
SPI_CLK: 02 LP_FMC (R14.2), 03 AD9361_Digital (U1.J5)
SPI_DI: 02 LP_FMC (P1.C26), 03 AD9361_Digital (U1.J4)
SPI_DO: 02 LP_FMC (P1.C27), 03 AD9361_Digital (U1.L6)
SPI_ENB: 02 LP_FMC (P1.D26 R12.1), 03 AD9361_Digital (U1.K6)
SYNC_IN: 02 LP_FMC (P1.H23), 03 AD9361_Digital (R38.2 U1.H5)
TX_D0_N: 02 LP_FMC (P1.H17), 03 AD9361_Digital (U1.E12)
TX_D0_P: 02 LP_FMC (P1.H16), 03 AD9361_Digital (U1.D11)
TX_D1_N: 02 LP_FMC (P1.G16), 03 AD9361_Digital (U1.E11)
TX_D1_P: 02 LP_FMC (P1.G15), 03 AD9361_Digital (U1.D10)
TX_D2_N: 02 LP_FMC (P1.D18), 03 AD9361_Digital (U1.E10)
TX_D2_P: 02 LP_FMC (P1.D17), 03 AD9361_Digital (U1.D9)
TX_D3_N: 02 LP_FMC (P1.C15), 03 AD9361_Digital (U1.E9)
TX_D3_P: 02 LP_FMC (P1.C14), 03 AD9361_Digital (U1.D8)
TX_D4_N: 02 LP_FMC (P1.C19), 03 AD9361_Digital (U1.E8)
TX_D4_P: 02 LP_FMC (P1.C18), 03 AD9361_Digital (U1.D7)
TX_D5_N: 02 LP_FMC (P1.H20), 03 AD9361_Digital (U1.F8)
TX_D5_P: 02 LP_FMC (P1.H19), 03 AD9361_Digital (U1.E7)
TX_FRAME_N: 02 LP_FMC (P1.D15), 03 AD9361_Digital (U1.H9)
TX_FRAME_P: 02 LP_FMC (P1.D14), 03 AD9361_Digital (U1.G9)
TXNRX: 02 LP_FMC (P1.G19 P2.2), 03 AD9361_Digital (U1.H4)
VADJ: 01 POWER (C48.1 C49.1 E3.2), 02 LP_FMC (P1.G39 P1.H40)
VDDA_GPO: 01 POWER (6 pins), 02 LP_FMC (R22.1 TP240.1), 03 AD9361_Digital (U1.B8)